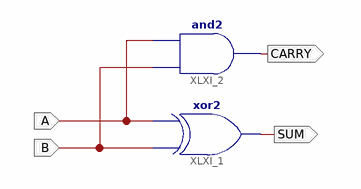
[diagram p0: schematic sheet 1]
// Xilinx ISE schematic half_adder.sch (zynq) as structural Verilog: 2 symbols, 4 ports
module half_adder (
  input  A,
  input  B,
  output SUM,
  output CARRY
);

  xor XLXI_1 (SUM, B, A);
  and XLXI_2 (CARRY, B, A);
endmodule
